# Altium project Ultrasound_Test_Prototype.PrjPcb
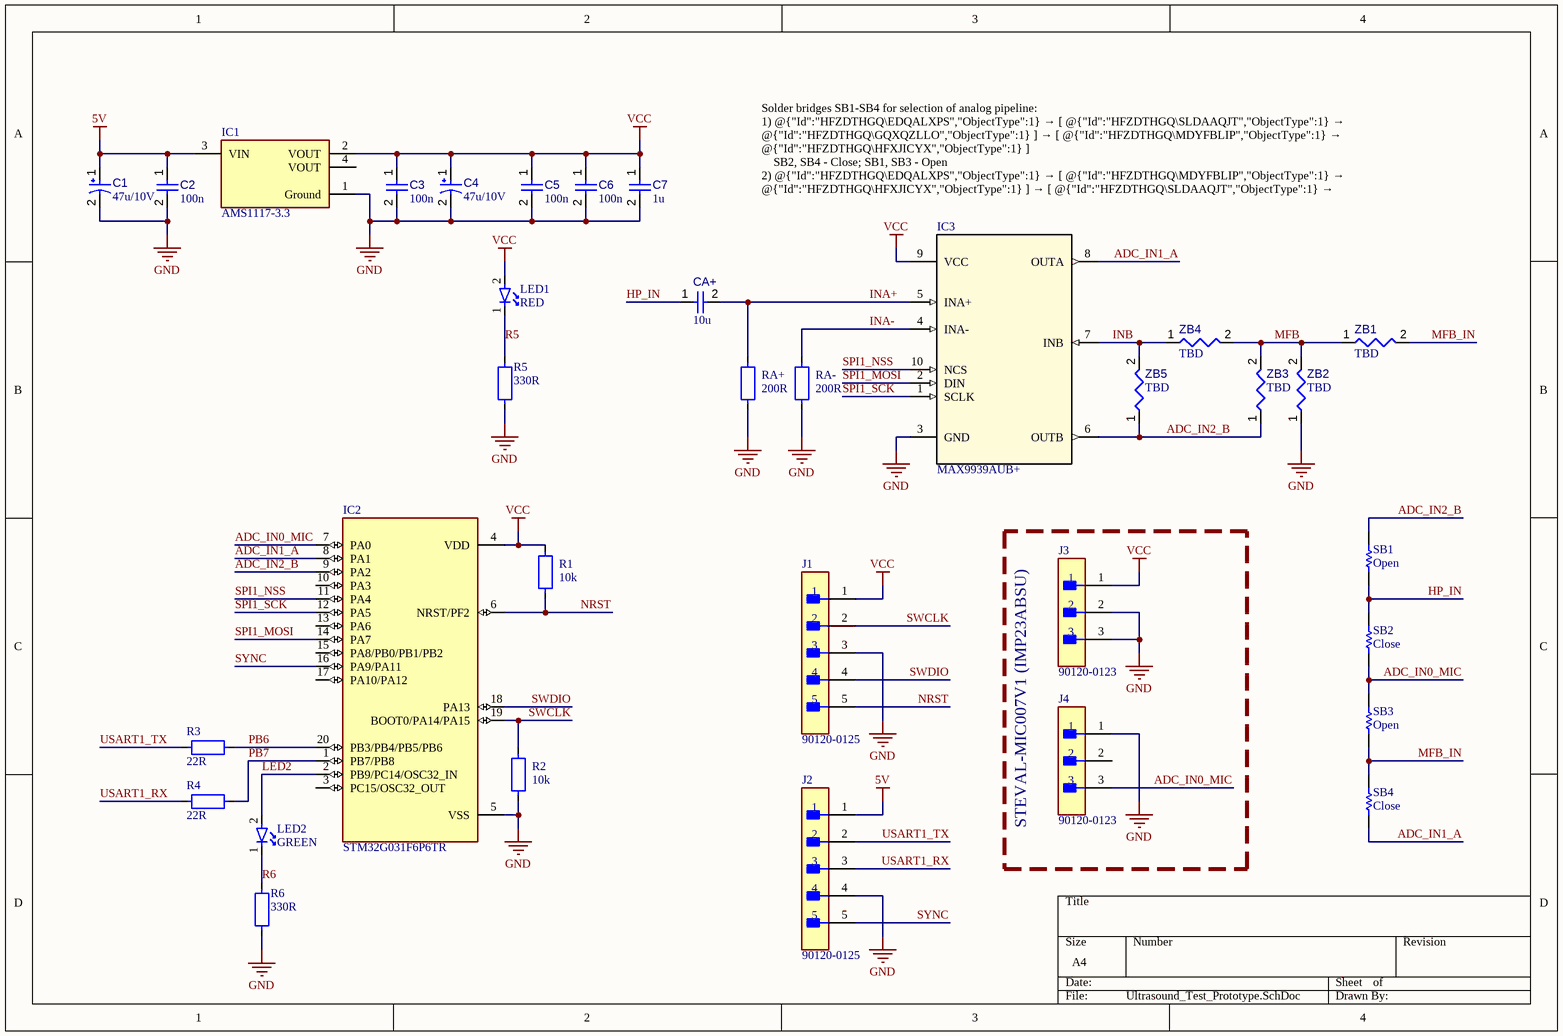
[diagram p0: Ultrasound_Test_Prototype.SchDoc]
1 sheet, 34 parts. Net scope: global (net labels, ports and power ports of the same name join across sheets).
Board file: Ultrasound_Test_Prototype.PcbDoc

## Sheet Ultrasound_Test_Prototype.SchDoc
size A4; SheetNumber: 1; SheetTotal: 1

### Parts
C1  value 47u/10V  [AVX-TAJ-C-2_L]  (hidden comment: TAJC107K010RNJ)
C2  value 100n  [CAPC0603(1608)100_L]  (hidden comment: Capacitor 1µF +/-0.1% 25V 0603)
C3  value 100n  [CAPC0603(1608)100_L]  (hidden comment: Capacitor 1µF +/-0.1% 25V 0603)
C4  value 47u/10V  [AVX-TAJ-C-2_L]  (hidden comment: TAJC107K010RNJ)
C5  value 100n  [CAPC0603(1608)100_L]  (hidden comment: Capacitor 1µF +/-0.1% 25V 0603)
C6  value 100n  [CAPC0603(1608)100_L]  (hidden comment: Capacitor 1µF +/-0.1% 25V 0603)
C7  value 1u  [CAPC0603(1608)100_L]  (hidden comment: Capacitor 1µF +/-0.1% 25V 0603)
CA+  value 10u  [CAPC0603(1608)100_L]  (hidden comment: Capacitor 1µF +/-0.1% 25V 0603)
IC1  AMS1117-3.3  [FP-AMS1117-IPC_B]
IC2  STM32G031F6P6TR  [SOIC65P640X120-20N]
IC3  MAX9939AUB+  [21-0061L_MXM-M]
J1  90120-0125  [FP-90120-0125-MFG]
J2  90120-0125  [FP-90120-0125-MFG]
J3  90120-0123  [FP-90120-0123-MFG]
J4  90120-0123  [FP-90120-0123-MFG]
LED1  RED  [FP-SML-21-MFG]
LED2  GREEN  [FP-SML-21-MFG]
R1  value 10k  [FP-CRCW0603-e3-IPC_C]  (hidden comment: Resistor European)
R2  value 10k  [FP-CRCW0603-e3-IPC_C]  (hidden comment: Resistor European)
R3  value 22R  [FP-CRCW0603-e3-IPC_C]  (hidden comment: Resistor European)
R4  value 22R  [FP-CRCW0603-e3-IPC_C]  (hidden comment: Resistor European)
R5  value 330R  [FP-CRCW0603-e3-IPC_C]  (hidden comment: Resistor European)
R6  value 330R  [FP-CRCW0603-e3-IPC_C]  (hidden comment: Resistor European)
RA+  value 200R  [FP-CRCW0603-e3-IPC_C]  (hidden comment: Resistor European)
RA-  value 200R  [FP-CRCW0603-e3-IPC_C]  (hidden comment: Resistor European)
SB1  value Open  [RESC1005X40X25ML05T05]  (hidden comment: Resistor 0R +/- 5% 0402 100 mW)
SB2  value Close  [RESC1005X40X25ML05T05]  (hidden comment: Resistor 0R +/- 5% 0402 100 mW)
SB3  value Open  [RESC1005X40X25ML05T05]  (hidden comment: Resistor 0R +/- 5% 0402 100 mW)
SB4  value Close  [RESC1005X40X25ML05T05]  (hidden comment: Resistor 0R +/- 5% 0402 100 mW)
ZB1  value TBD  [RESC1608X55X25ML10T15]  (hidden comment: Resistor 10k +/-1% 0603 100 mW)
ZB2  value TBD  [RESC1608X55X25ML10T15]  (hidden comment: Resistor 10k +/-1% 0603 100 mW)
ZB3  value TBD  [RESC1608X55X25ML10T15]  (hidden comment: Resistor 10k +/-1% 0603 100 mW)
ZB4  value TBD  [RESC1608X55X25ML10T15]  (hidden comment: Resistor 10k +/-1% 0603 100 mW)
ZB5  value TBD  [RESC1608X55X25ML10T15]  (hidden comment: Resistor 10k +/-1% 0603 100 mW)

### Blocks framed on the sheet
STEVAL-MIC007V1 (IMP23ABSU): J3 J4

### Nets
5V: C1.1 C2.1 IC1.3(VIN) J2.1
GND: C1.2 C2.2 C3.2 C4.2 C5.2 C6.2 C7.2 IC1.1(Ground) IC2.5(VSS) IC3.3(GND) J1.3 J2.4 J3.2 J3.3 J4.1 R2.1 R5.2 R6.2 RA+.1 RA-.1 ZB2.1
VCC: C3.1 C4.1 C5.1 C6.1 C7.1 IC1.2(VOUT) IC2.4(VDD) IC3.9(VCC) J1.1 J3.1 LED1.2(A) R1.2
ADC_IN0_MIC: IC2.7(PA0) J4.3 SB2.1 SB3.2
ADC_IN1_A: IC2.8(PA1) IC3.8(OUTA) SB4.1
ADC_IN2_B: IC2.9(PA2) IC3.6(OUTB) SB1.2 ZB3.1 ZB5.1
HP_IN: CA+.1 SB1.1 SB2.2
INA+: CA+.2 IC3.5(INA+) RA+.2
INA-: IC3.4(INA-) RA-.2
INB: IC3.7(INB) ZB4.1 ZB5.2
LED2: IC2.2(PB9/PC14/OSC32_IN) LED2.2(A)
MFB: ZB1.1 ZB2.2 ZB3.2 ZB4.2
MFB_IN: SB3.1 SB4.2 ZB1.2
NRST: IC2.6(NRST/PF2) J1.5 R1.1
PB6: IC2.20(PB3/PB4/PB5/PB6) R3.1
PB7: IC2.1(PB7/PB8) R4.1
R5: LED1.1(C) R5.1
R6: LED2.1(C) R6.1
SPI1_MOSI: IC2.14(PA7) IC3.2(DIN)
SPI1_NSS: IC2.11(PA4) IC3.10(NCS)
SPI1_SCK: IC2.12(PA5) IC3.1(SCLK)
SWCLK: IC2.19(BOOT0/PA14/PA15) J1.2 R2.2
SWDIO: IC2.18(PA13) J1.4
SYNC: IC2.16(PA9/PA11) J2.5
USART1_RX: J2.3 R4.2
USART1_TX: J2.2 R3.2

Not connected (* = marked no-connect by the designer): IC1 4(VOUT); IC2 3(PC15/OSC32_OUT) 10(PA3) 13(PA6) 15(PA8/PB0/PB1/PB2) 17(PA10/PA12); J4 2

### Notes on the sheet
- Solder bridges SB1-SB4 for selection of analog pipeline:
  1) @{"Id":"HFZDTHGQ\EDQALXPS","ObjectType":1} → [ @{"Id":"HFZDTHGQ\SLDAAQJT","ObjectType":1} → @{"Id":"HFZDTHGQ\GQXQZLLO","ObjectType":1} ] → [ @{"Id":"HFZDTHGQ\MDYFBLIP","ObjectType":1} →  @{"Id":"HFZDTHGQ\HFXJICYX","ObjectType":1} ]
  SB2, SB4 - Close; SB1, SB3 - Open
  2) @{"Id":"HFZDTHGQ\EDQALXPS","ObjectType":1} → [ @{"Id":"HFZDTHGQ\MDYFBLIP","ObjectType":1} → @{"Id":"HFZDTHGQ\HFXJICYX","ObjectType":1} ] → [ @{"Id":"HFZDTHGQ\SLDAAQJT","ObjectType":1} → @{"Id":"HFZDTHGQ\GQXQZLLO","ObjectType":1} ]
  SB2, SB4 - Open; SB1, SB3 - Close
  [ @{"Id":"HFZDTHGQ\SLDAAQJT","ObjectType":1} → @{"Id":"HFZDTHGQ\GQXQZLLO","ObjectType":1} ] = High-Pass input PGA; [ @{"Id":"HFZDTHGQ\MDYFBLIP","ObjectType":1} →  @{"Id":"HFZDTHGQ\HFXJICYX","ObjectType":1} ] = Multi-Feedback Filter (ZB1 to ZB5)

### Library data of the parts
C1 C4 = CMP-001-00045-7: Standard Tantalum, 100 uF, +/- 10%, 10 V, -55 to 125 degC, 2312 (6032 Metric), RoHS, Tape and Reel; Manufacturer: AVX; Voltage Rating: 10V; ESR: 1.2Ohm; Datasheet URL: http://datasheets.avx.com/TAJ.pdf; Pins: 2; Tolerance: 10%; Packaging: TapeandReel; Capacitor Type: Tantalum; Datasheet Version: Feb-16; Package Quantity: 500; Min Operating Temperature: -55°C; Mounting Technology: SM; Case/Package: 2412; Manufacturer URL: http://www.avx.com/; RoHS Compliant: True; Package Description: 2-Pin Surface Mount Device, Body 6 x 3.25 mm; Max Operating Temperature: 125°C; Package Reference: TAJ-C-2
C2 C3 C5-C7 CA+ = CMP-001-00055-4: Chip Capacitor, 1µF +/-0.1%, 25V, 0603, Thickness 1 mm; Tolerance: 20%; Min Operating Temperature: -55°C; Max Operating Temperature: 85°C; Voltage Rating: 25V; Mounting Technology: SMT; Case/Package: 0603; Pins: 2
IC1 = CMP-019-00055-1: Fixed Positive LDO Regulator, 3.3V, 1.3V Dropout, PDSO3; RoHS Compliant: Yes
IC2 = CMP-020-00030-1: Microcontroller 32-Bit ARM Cortex M0 32KByte Flash 1.7V to 3.6V 20-Pin TSSOP T/R; Nominal Supply Voltage: 3.3V; Clock Frequency: 64MHz; I/Os: 18; RAM Size: 8kB; Case/Package: TSSOP-20; Pins: 20; Min Supply Voltage: 1.7V; Min Operating Temperature: -40°C; Max Operating Temperature: 85°C; Mounting Technology: SMD; Max Supply Voltage: 3.6V
IC3 = CMP-014-00005-2: SPI-Programmable Gain Amplifier (PGA) with Input VOS Trim and Output Op Amp; Input Offset Voltage-Max: 15mV; Unity Gain BW-Nom: 2.2MHz; Nominal Supply Voltage: 5V; Power Supplies: 3/5V; Amplifier Type: OPERATIONAL AMPLIFIER; Supply Voltage Limit-Max: 6V; Package Equivalence Code: TSSOP10,.19,20; Slew Rate: 6.4V/µs; Max Supply Current: 6.7mA; Channels: 1; Qualification Status: Not Qualified; Package Body Material: Plastic; Surface Mount: Yes; Terminal Position: DUAL; Case/Package: UMAX-10; Temperature Grade: AUTOMOTIVE; Length: 3mm; Terminal Pitch: 0.5mm; Package Style: SMALL OUTLINE, THIN PROFILE, SHRINK PITCHMeter; Technology: BICMOS; Terminal Finish: Tin; Max Operating Temperature: 125°C; JESD-30 Code: S-PDSO-G10; Moisture Sensitivity Level: 1; Height - Seated (Max): 1.1mm; Width: 3mm; Terminal Form: Gull Wing; Reach SVHC Compliant: Yes; RoHS Compliant: Yes; Pins: 10; JESD-609 Code: e3; Min Operating Temperature: -40°C; Package Shape: Square
J1 J2 = CMP-002-00091-1: Board Connector, 5 Contact(s), 1 Row(s), Male, Straight, 0.1 inch Pitch, Solder Terminal, Black Insulator, Receptacle; PCB Contact Pattern: RECTANGULAR; Insulation Resistance: 5GR; Contact Style: SQ PIN-SKT; Body Depth: 0.098inch; Reliability: COMMERCIAL; Reference Standard: UL; DIN Conformance: No; Plating Thickness: 160uin; Number Of Connectors: 1; Rated Current (Signal): 3A; Insertion Force-Max: 3.0024N; Dielectric Withstanding Voltage (DC): 350V; Number of Contacts: 5; Withdrawl Force-Min: 0.1946N; Option: General Purpose; Mating Information: MULTIPLE MATING PARTS AVAILABLE; Body Length: 0.5inch; Contact Resistance: 20mR; Body Breadth: 0.1inch; Insulation Material: Glass; Terminal Pitch: 2.54mm; Mounting Style: STRAIGHT; Contact Pattern: RECTANGULAR; Contact Finish - Termination: Gold (Au); Termination: Solder; Contact Gender: Male; Reach SVHC Compliant: Yes; Flammability Rating: UL94 V-0; Insulation Color: Black; Body/Shell Style: RECEPTACLE; Number of Rows Loaded: 1; Contact Finish - Mating: NOT SPECIFIED; Mating Contact Pitch: 0.1inch; Mounting Technology: Board; MIL Conformance: No; Filter Feature: No; Max Operating Temperature: 125°C; Terminal Length: 0.114inch; Number Of PCB Rows: 1; Connector Type: BOARD CONNECTOR; RoHS Compliant: Yes; Contact Material: Copper Alloy; Min Operating Temperature: -55°C; JESD-609 Code: e4; Mixed Contacts: No; IEC Conformance: No
J3 J4 = CMP-002-00092-1: Board Connector, 3 Contact(s), 1 Row(s), Male, Straight, 0.1 inch Pitch, Solder Terminal, Black Insulator, Receptacle; Reliability: COMMERCIAL; Number Of PCB Rows: 1; Rated Current (Signal): 3A; Contact Pattern: RECTANGULAR; Dielectric Withstanding Voltage (DC): 350V; IEC Conformance: No; Body Length: 0.3inch; Plating Thickness: 160uin; Mating Information: MULTIPLE MATING PARTS AVAILABLE; Withdrawl Force-Min: 0.1946N; Contact Style: SQ PIN-SKT; Insertion Force-Max: 3.0024N; Body Depth: 0.098inch; Option: General Purpose; Contact Resistance: 20mR; Insulation Resistance: 5GR; Number of Contacts: 3; Reference Standard: UL; RoHS Compliant: Yes; Body/Shell Style: RECEPTACLE; Min Operating Temperature: -55°C; Termination: Solder; Contact Finish - Termination: Matte Tin (Sn) - with Nickel (Ni) barrier; Terminal Pitch: 2.54mm; Mating Contact Pitch: 0.1inch; JESD-609 Code: e3; Flammability Rating: UL94 V-0; Mixed Contacts: No; Contact Finish - Mating: NOT SPECIFIED; Connector Type: BOARD CONNECTOR; Insulation Color: Black; MIL Conformance: No; DIN Conformance: No; Contact Material: Copper Alloy; Reach SVHC Compliant: Yes; Filter Feature: No; Number of Rows Loaded: 1; PCB Contact Pattern: RECTANGULAR; Insulation Material: Glass; Max Operating Temperature: 125°C; Mounting Style: STRAIGHT; Number Of Connectors: 1; Terminal Length: 0.114inch; Mounting Technology: Board; Body Breadth: 0.1inch; Contact Gender: Male
LED1 LED2 = CMP-007-00036-1: Single Color LED, Red, Colorless Transparent, 1.4mm; Channels: 1; Reverse Voltage-Max: 4V; Luminous Intensity-Nom: 4mcd; Forward Current: 25mA; Overall Height: 0.8mm; Shape: Rectangular; Lens Style: Colorless,TRANSPARENT; JESD-609 Code: e4; Color: Red; Mounting Technology: Surface Mount; Terminal Pitch: 1.35mm; Max Operating Temperature: 85°C; RoHS Compliant: Yes; Case/Package: 0805; Reach SVHC Compliant: Yes; Packaging: Bulk; Size: 1.4mm; Pins: 2; Terminal Finish: Nickel; Color@wavelength: Red; Optoelectronic Device Type: SINGLE COLOR LED; Min Operating Temperature: -30°C
R1-R6 RA+ RA- = CMP-009-00177-6: Resistor European Symbol; Pins: 2
SB1-SB4 = CMP-009-00005-5: Chip Resistor, 0 Ohm, 0.1 W, -55 to 155 degC, 0402 (1005 Metric); Power: 100mW; Voltage Rating: 50V; Pins: 2; Tolerance: 5%; Case/Package: 0402; Mounting Technology: SM; Max Operating Temperature: 155°C; Min Operating Temperature: -55°C; RoHS Compliant: True
ZB1-ZB5 = CMP-009-00017-5: Chip Resistor, 10 KOhm, +/- 1%, 01 W, -55 to 155 degC, 0603 (1608 Metric); Voltage Rating: 50V; Power: 100mW; RoHS Compliant: True; Min Operating Temperature: -55°C; Pins: 2; Case/Package: 0603; Mounting Technology: SM; Max Operating Temperature: 155°C; Tolerance: 1%